# Altium schematic sheet kanal.SchDoc
size A4
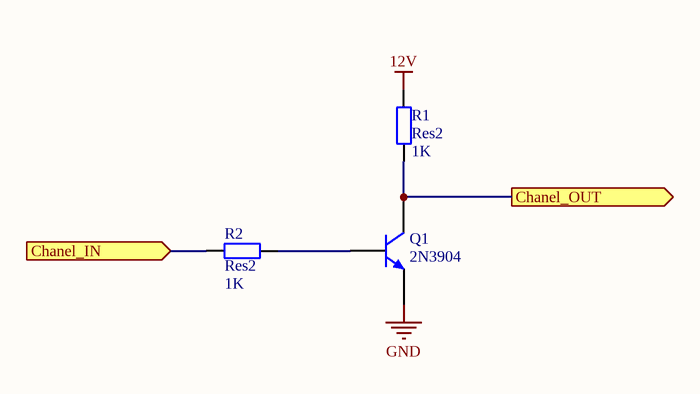
[diagram p0: kanal.SchDoc]

## Parts
Q1  2N3904  [TO-92A]
R1  Res2  value 1K  [AXIAL-0.4]
R2  Res2  value 1K  [AXIAL-0.4]

## Ports
Chanel_IN (in), Chanel_OUT (out)

## Nets
12V: R1.2
GND: Q1.1(E)
Chanel_IN: R2.1 ; port Chanel_IN
Chanel_OUT: Q1.3(C) R1.1 ; port Chanel_OUT
NetQ1_2: Q1.2(B) R2.2

## Library data of the parts
Q1 = 2N3904: NPN General Purpose Amplifier; Published: 8-Jun-2000; LatestRevisionDate: 15-Jan-2003; LatestRevisionNote: PCB Footprint 'BCY-W3/D4.7' replaced; DatasheetVersion: 1997; PackageVersion: Sep-1998; PackageReference: TO-92A; Publisher: Altium Limited; PackageDescription: TO, Flat Index; 3 In-Line, Axial Leads; Body Dia. 4.5mm; Leads 0.51 x 0.48 mm (max); ComponentLink1Description: Manufacturer Link; ComponentLink1URL: http://www.fairchildsemi.com/; ComponentLink2Description: Datasheet; ComponentLink2URL: http://www.fairchildsemi.com/ds/2N%2F2N3904.pdf
R1 R2 = Res2: Resistor; Published: 8-Jun-2000; LatestRevisionDate: 17-Jul-2002; LatestRevisionNote: Re-released for DXP Platform.; PackageReference: AXIAL-0.4; Publisher: Altium Limited; PackageDescription: Axial Device, Thru-Hole; 2 Leads; 0.4 in Pin Spacing